# Altium schematic sheet powersupply1.SchDoc
size A; SheetNumber: 1; SheetTotal: 1; SPICEModelCacheSHAHFHRU: <root> / <DocumentId>SHAHFHRU</DocumentId> / </root>
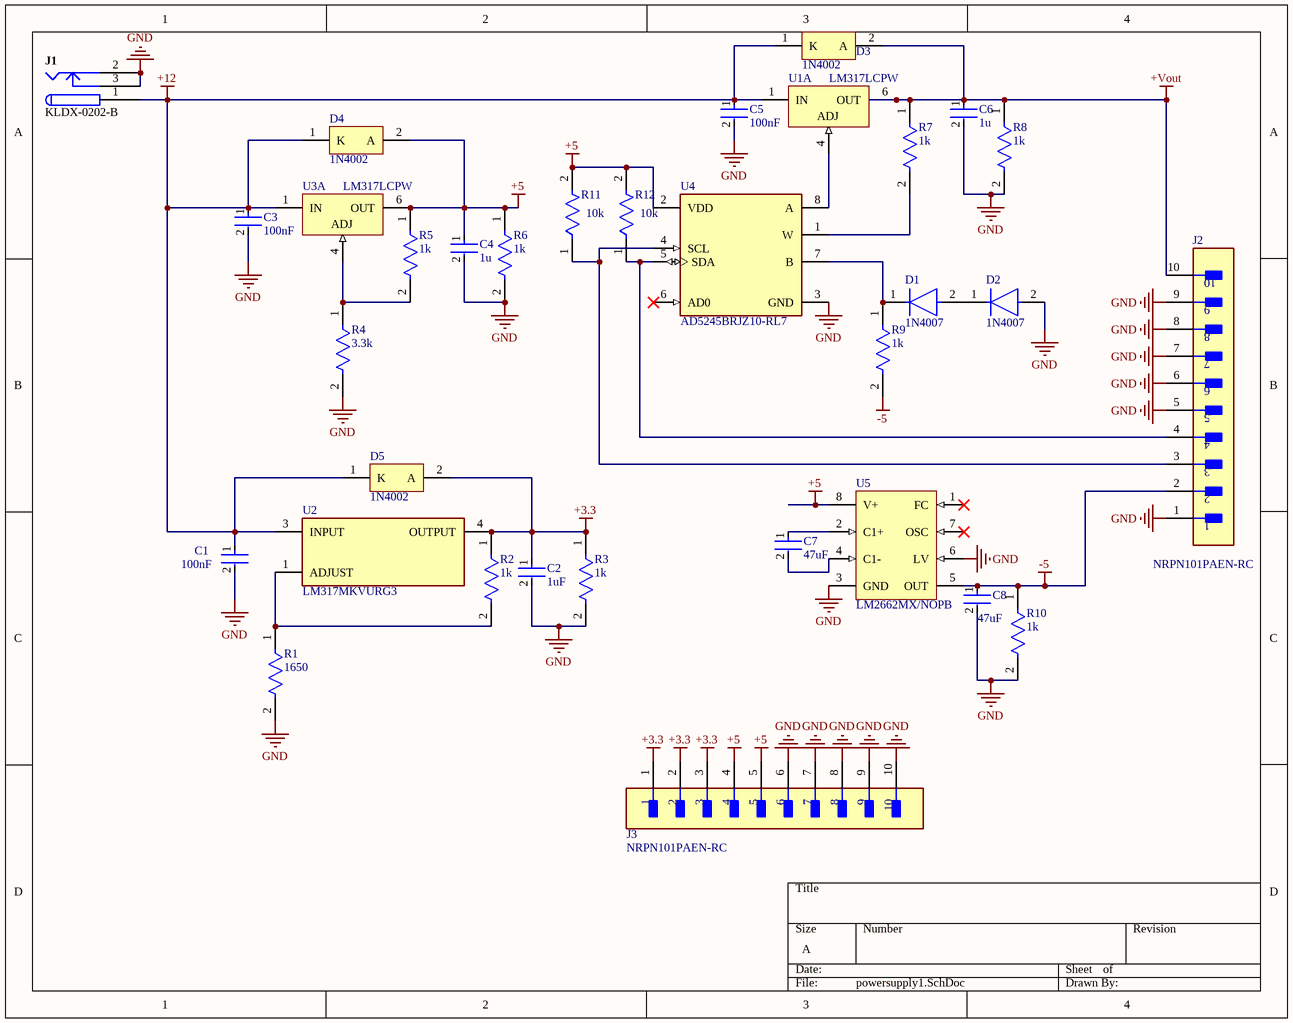
[diagram p0: powersupply1.SchDoc]

## Parts
C1  100nF  [FP-CC0805-0_85-MFG]
C2  1uF  [FP-CC0805-0_85-MFG]
C3  100nF  [FP-CC0805-0_85-MFG]
C4  1u  [FP-CC0805-0_85-MFG]
C5  100nF  [FP-CC0805-0_85-MFG]
C6  1u  [FP-CC0805-0_85-MFG]
C7  47uF  [FP-GRM21B-0_2-e0_2_0_7-IPC_A]
C8  47uF  [FP-GRM21B-0_2-e0_2_0_7-IPC_A]
D1  1N4007  [FP-1N4007-MFG]
D2  1N4007  [FP-1N4007-MFG]
D3  1N4002  [ONSC-AXIAL_LEAD-2-59-10_P]
D4  1N4002  [ONSC-AXIAL_LEAD-2-59-10_P]
D5  1N4002  [ONSC-AXIAL_LEAD-2-59-10_P]
J1  KLDX-0202-B  [KYCN-KLDX-0202-B_V]
J2  NRPN101PAEN-RC  [FP-NRPN101PAEN-RC-MFG]
J3  NRPN101PAEN-RC  [FP-NRPN101PAEN-RC-MFG]
R1  1650  [FP-RT0805-MFG]
R2  1k  [FP-RMCF0805-MFG]
R3  1k  [FP-RMCF0805-MFG]
R4  3.3k  [FP-CRGCQ0805-IPC_C]
R5  1k  [FP-RMCF0805-MFG]
R6  1k  [FP-RMCF0805-MFG]
R7  1k  [FP-RMCF0805-MFG]
R8  1k  [FP-RMCF0805-MFG]
R9  1k  [FP-RMCF0805-MFG]
R10  1k  [FP-RMCF0805-MFG]
R11  10k  [FP-RT0805-MFG]
R12  10k  [FP-RT0805-MFG]
U1  LM317LCPW  [PW0008A_L]  (part A of 2)
U2  LM317MKVURG3  [FP-KVU0003A-MFG]
U3  LM317LCPW  [PW0008A_L]  (part A of 2)
U4  AD5245BRJZ10-RL7  [FP-RJ-8-IPC_B]
U5  LM2662MX/NOPB  [D0008A_M]

## Nets
+3.3: C2.1 D5.2(A) J3.1 J3.2 J3.3 R2.1 R3.1 U2.4(OUTPUT)
+5: C4.1 D4.2(A) J3.4 J3.5 R5.1 R6.1 R11.2 R12.2 U3.6(OUT) U4.2(VDD) U5.8(V+)
+12: C1.1 C3.1 C5.1 D3.1(K) D4.1(K) D5.1(K) J1.1 U1.1(IN) U2.3(INPUT) U3.1(IN)
+Vout: C6.1 D3.2(A) J2.10 R7.1 R8.1 U1.6(OUT)
-5: C8.1 J2.2 R9.2 R10.1 U5.5(OUT)
GND: C1.2 C2.2 C3.2 C4.2 C5.2 C6.2 C8.2 D2.2(A) J1.2 J1.3 J2.1 J2.5 J2.6 J2.7 J2.8 J2.9 J3.6 J3.7 J3.8 J3.9 J3.10 R1.2 R3.2 R4.2 R6.2 R8.2 R10.2 U4.3(GND) U5.3(GND) U5.6(LV)
NetC7_1: C7.1 U5.2(C1+)
NetC7_2: C7.2 U5.4(C1-)
NetD1_1: D1.1(C) R9.1 U4.7(B)
NetD1_2: D1.2(A) D2.1(C)
NetJ2_3: J2.3 R11.1 U4.4(SCL)
NetJ2_4: J2.4 R12.1 U4.5(SDA)
NetR1_1: R1.1 R2.2 U2.1(ADJUST)
NetR4_1: R4.1 R5.2 U3.4(ADJ)
NetR7_2: R7.2 U4.1(W)
NetU1_4: U1.4(ADJ) U4.8(A)

Not connected (* = marked no-connect by the designer): U4 6(AD0)*; U5 1(FC)* 7(OSC)*

## Library data of the parts
C1 C3 C5 = CMP-03422-000691-1: CAP CER 0.1UF 25V X7R 0805; Manufacturer: Yageo; Manufacturer Part Number: CC0805MRX7R8BB104; Tolerance: 0.2; Material: Ceramic; Voltage Rating: 25 V; Ipc Land Pattern Name: CAPC200125X85; Automotive: No; Package: CC0805-0.85; Device Class L3: Ceramic Capacitors; Temperature Characteristic: X7R; Temperature Range High: +85°C; Temperature: -30°C to +85°C; Octopart: https://octopart.com/cc0805mrx7r8bb104-yageo-25629596; ComponentLink2URL: http://www.yageo.com/documents/recent/UPY-GPHC_Y5V_6.3V-to-50V_8.pdf; Height: 0.95mm; Capacitance: 100 nF; Mouser Description: Multilayer Ceramic Capacitors MLCC - SMD/SMT 100nF 25V X7R 20%; Device Class L1: Passive Components; Category: Cap; Device Class L2: Capacitors; RoHS: TRUE; Digikey Description: CAP CER 0.1UF 25V X7R 0805; Temperature Range Low: -30°C; Value: 100 nF; ComponentLink2Description: Datasheet; Footprint Url: http://www.yageo.com/exep/pages/download/literatures/UPY-C_GEN_24.pdf; Lead Free: Yes
C2 C4 C6 = CMP-03422-000816-1: CAP CER 1UF 6.3V X5R 0805; Manufacturer: Yageo; Manufacturer Part Number: CC0805KKX5R5BB105; Material: Ceramic; Tolerance: 0.1; Device Class L1: Passive Components; Temperature Characteristic: X5R; Voltage Rating: 6.3 V; Footprint Url: http://www.yageo.com/exep/pages/download/literatures/UPY-C_GEN_24.pdf; Value: 1 uF; Package: CC0805-0.85; Temperature Range High: +85°C; Height: 0.95mm; Temperature Range Low: -30°C; Lead Free: Yes; RoHS: TRUE; Octopart: https://octopart.com/cc0805kkx5r5bb105-yageo-71334571; Capacitance: 1 uF; Ipc Land Pattern Name: CAPC200125X85; Category: Cap; Digikey Description: CAP CER 1UF 6.3V X5R 0805; ComponentLink2URL: http://www.yageo.com/documents/recent/UPY-GPHC_Y5V_6.3V-to-50V_8.pdf; Automotive: No; Device Class L2: Capacitors; ComponentLink2Description: Datasheet; Device Class L3: Ceramic Capacitors; Temperature: -30°C to +85°C
C7 C8 = CMP-2000-06341-2: Chip Multilayer Ceramic Capacitors for General Purpose, 0805, 47uF, X5R, 15%, 20%, 10V; Dissipation Factor: 0.035%; Length: 2mm; Voltage Rating: 10V; Mount: Surface Mount; Width: 0.049inch; Voltage Rating (DC): 10V; Lead Free: Lead Free; REACH SVHC: No SVHC; Termination: SMD/SMT; Case/Package: 0805; Dielectric: X5R; Capacitance: 47uF; Packaging: Tape and Reel; Max Operating Temperature: 85°C; Tolerance: 20%; Thickness: 0.057inch; Dielectric Material: Ceramic; Min Operating Temperature: -55°C; Height: 1.25mm; Case Code (Imperial): 0805; Case Code (Metric): 2012; Depth: 1.25mm; Voltage: 10V
D1 D2 = CMP-123542-000001-1: Rectifier diode 1000 V 1 A DO-41, ,; Manufacturer: Diotec; Max Surge Forward Current: 27A; Forward Current: 1A; Max Junction Temp: +175°C; Reverse Voltage: 1000V; Value: 15pF; Peak Reverse Current: 5uA; Category: Diode; Temperature Range Low: -50°C; Automotive: No; Temperature: -50°C to +175°C; Lead Free: Yes; ComponentLink2Description: Datasheet; Max Repetitive Reverse Voltage: 1000V; ComponentLink2URL: https://datasheet.octopart.com/1N4007-Diotec-datasheet-62346875.pdf; Manufacturer Part Number: 1N4007; Device Class L3: Rectifier Diodes; Height: 2.8mm; Octopart: https://octopart.com/1n4007-diotec-4040411; Package: 1N4007; Temperature Range High: +175°C; Device Class L1: Discrete Semiconductors; Device Class L2: Diodes; RoHS: TRUE; Capacitance: 15pF; Ipc Land Pattern Name: DIOAD888W100L520D280
D3-D5 = CMP-0902-00207-1: Standard Recovery Rectifier, 2-Pin Axial_Lead, Pb-Free, Bulk Bag; Manufacturer: On Semiconductor; IO(rec) Max (A): 1; IFSM Max (A): 30; VRRM Max (V): 100; ComponentLink3Description: Package Specification; ComponentLink1Description: Manufacturer URL; Type: Standard Recovery; PackageVersion: Rev. U, 02/2005; Mounting Technology: Through Hole; ComponentLink1URL: http://www.onsemi.com/; ComponentLink3URL: http://www.onsemi.cn/pub_link/Collateral/59-10.PDF; ComponentLink2URL: http://www.onsemi.com/pub_link/Collateral/1N4001-D.PDF; Packing: Bulk Bag; PackageDescription: 2-Pin, Axial Lead, Diameter 2.35 mm; ComponentLink2Description: Datasheet; PartNumber: 1N4002; DatasheetVersion: Rev. 13; PackageReference: AXIAL_LEAD-2-59-10; RoHS: TRUE
J1 = CMP-0256-00001-1: 3 Conductor Power Jack, 2 break 2 aux contacts; ComponentLink2URL: http://anacapa.kycon.com/Catalog_PDF/KLDX_0202.pdf; PackageReference: KLDX-0202-B; Contact Finish: Brass; ComponentLink2Description: Datasheet; Mounting Technology: Through Hole; PackageDescription: Jack, 9 x 14.5 mm Body, 2.5 mm Center Pin Diameter; ComponentLink1Description: Manufacturer URL; PartNumber: KLDX-0202-B; ComponentLink1URL: http://kycon.com/
J2 J3 = CMP-25680-000006-1: CONN HEADER VERT 10POS 2MM; Manufacturer: Sullins; Current Rating: 2A; Conn Gender: Male; Voltage Rating: 150V; Conn Orientation: Straight; Number Of Contacts: 10; Temperature: -40°C to +105°C; Manufacturer Part Number: NRPN101PAEN-RC; Package: 0; Lead Free: Yes; Device Class L3: unset; Octopart: https://octopart.com/nrpn101paen-rc-sullins-18674398; Device Class L1: Connectors; Contact Material: Gold,Nickel; ComponentLink2URL: https://s3.amazonaws.com/catalogspreads-pdf/PAGE104-105%202mm%20MALE%20HDR%20ST%20RA%20SMT.pdf; Footprint Url: https://drawings-pdf.s3.amazonaws.com/10531.pdf; Height: 5.95mm; Digikey Description: CONN HEADER VERT 10POS 2MM; Category: Conn; Automotive: No; Number Of Rows: 1; Device Class L2: Headers and Wire Housings; Temperature Range High: +105°C; Temperature Range Low: -40°C; Pitch: 2mm; RoHS: TRUE; ComponentLink2Description: Datasheet
R1 = CMP-03412-005070-1: RES SMD 1.65K OHM 1% 1/8W 0805; Manufacturer: Yageo; Manufacturer Part Number: RT0805FRE071K65L; Power Rating: 0.125W; Tolerance: 0.0001; Resistance: 1.65KΩ; Temperature Coefficient: 50 ppm/°C; Voltage Rating: 150V; Value: 1.65KΩ; ComponentLink2URL: http://www.yageo.com/documents/recent/PYu-RT_1-to-0.01_RoHS_L_9.pdf; Height: 0.6mm; Temperature Range High: +155°C; Device Class L3: Chip SMD Resistors; Octopart: https://octopart.com/rt0805fre071k65l-yageo-1226722; ComponentLink2Description: Datasheet; Digikey Description: RES SMD 1.65K OHM 1% 1/8W 0805; Mouser Description: Thin Film Resistors - SMD 1/8W 1.65K ohm 1% 50ppm; Temperature: -55°C to +155°C; RoHS: TRUE; Temperature Range Low: -55°C; Composition: Thin Film; Footprint Url: http://www.yageo.com/exep/pages/download/literatures/PYu-R_Mount_10.pdf; Package: RT0805; Ipc Land Pattern Name: RESC200125X50; Series: RT; Category: Res; Lead Free: Yes; Device Class L2: Resistors; Device Class L1: Passive Components; Automotive: No
R2 R3 R5-R10 = CMP-26527-002945-1: 1kΩ ±1% 0.125W 0805 Thick Film Chip Resistor AEC-Q200 compliant; Resistance: 1kR; Max Power Dissipation: 125mW; Temperature Coefficient: 100ppm/°C; Series: RMCF; Packaging: Tape and Reel; Depth: 1.25mm; Tolerance: 1%; Contact Plating: Tin; Height: 0.026inch; Length: 2mm; Resistor Type: Thick Film; Lead Free: Lead Free; Width: 0.049inch; Military Standard: Not; RoHS Compliant: Yes; Case/Package: 0805; Min Operating Temperature: -55°C; Mount: Surface Mount; Max Operating Temperature: 155°C; Construction: Rectangular; Features: Automotive AEC-Q200; Number of Terminations: 2; Radiation Hardening: No
R4 = CMP-03211-009851-1: CRGCQ0805 3.3KΩ 0.125W ±100ppm/°C 5% 150V; Manufacturer: TE Connectivity; Manufacturer Part Number: CRGCQ0805J3K3; Automotive Grade: Grade 800; Tolerance: 0.05; RoHS: TRUE; Temperature Range Low: -55°C; Resistance: 3.3KΩ; Height: 0.65mm; Temperature: -55°C to +155°C; Device Class L2: Resistors; Composition: Thick Film; Lead Free: Yes; ComponentLink2Description: Datasheet; ComponentLink2URL: https://www.te.com/commerce/DocumentDelivery/DDEController?Action=showdoc&DocId=Data+Sheet%7F1773204-3%7F1%7Fpdf%7FEnglish%7FENG_DS_1773204-3_1.pdf%7F4-2176341-809; Package: CRGCQ0805; Series: CRGCQ; Device Class L1: Passive Components; Ambient Temperature Range High: +70°C; Power Rating: 0.125W; Ipc Land Pattern Name: RESC200125X55; Temperature Coefficient: ±100ppm/°C; Automotive: Yes; Device Class L3: Chip SMD Resistors; Octopart: https://octopart.com/crgcq0805j3k3-te+connectivity-91018225; Temperature Range High: +155°C; Category: Res; Value: 3.3KΩ; Voltage Rating: 150V
R11 R12 = CMP-03412-035478-1: RES SMD 10K OHM 1% 1/8W 0805; Manufacturer Part Number: RT0805FRD0710KL; Manufacturer: Yageo; Tolerance: 0.0001; Temperature Coefficient: 25 ppm/°C; Power Rating: 0.125W; Value: 10KΩ; Voltage Rating: 150V; RoHS: TRUE; Footprint Url: http://www.yageo.com/exep/pages/download/literatures/PYu-R_Mount_10.pdf; Series: RT; Octopart: https://octopart.com/rt0805frd0710kl-yageo-71399701; Digikey Description: RES SMD 10K OHM 1% 1/8W 0805; Composition: Thin Film; Device Class L1: Passive Components; Automotive: No; ComponentLink2Description: Datasheet; Ipc Land Pattern Name: RESC200125X50; Device Class L2: Resistors; Resistance: 10KΩ; Temperature Range Low: -55°C; Device Class L3: Chip SMD Resistors; ComponentLink2URL: http://www.yageo.com/documents/recent/PYu-RT_1-to-0.01_RoHS_L_9.pdf; Temperature: -55°C to +155°C; Category: Res; Temperature Range High: +155°C; Lead Free: Yes; Package: RT0805; Height: 0.6mm
U1 U3 = CMP-0324-00206-3: Adjustable Regulator with 3.7 to 38 V Input and 1.2 to 32 V Output, 0 to 125 degC, 8-Pin TSSOP (PW), Green (RoHS & no Sb/Br); Manufacturer: Texas Instruments; Iout(Max)(A): 0.1; Vout(Max)(V): 32; Vin(Max)(V): 38; Vout(Min)(V): 1.2; Vin(Min)(V): 3.7; ComponentLink3Description: URL Link1; Mounting Technology: Surface Mount; DatasheetVersion: SLCS144D; ComponentLink3URL: Samples URL:http://www.ti.com/product/lm317l#samples; ComponentLink2Description: Package Specification; Code_JEDEC: MO-153; PackageDescription: 8-Pin Plastic Thin Small Outline Package 3 x 4.4 mm Body ,0.65 mm Pitch; PartNumber: LM317LCPW; ComponentLink2URL: http://www.ti.com/litv/pdf/mtss001d; ComponentLink1Description: Datasheet; PackageReference: PW0008A; Eco-Plan: Green (RoHS & no Sb/Br); ComponentLink1URL: http://www.ti.com/general/docs/lit/getliterature.tsp?genericPartNumber=LM317L&fileType=pdf; PackageVersion: revG, Feb-2011
U2 = CMP-04917-000136-1: IC REG LIN POS ADJ 500MA TO252-3; Min Output Voltage: 1.25V; Dropout Voltage: 2V; Polarity: Positive; Reference Voltage: 1.3V; Max Input Voltage: 40V; Min Input Voltage: 4.2V; Power Supply Rejection Ratio (PSRR): 80dB; Number of Outputs: 1; Max Output Voltage: 37V; Output Type: Adjustable; Quiescent Current: 3.5mA; Radiation Hardening: No; Number of Pins: 3; Package Quantity: 2500; RoHS Compliant: Yes; Height: 2.39mm; Contact Plating: Tin; Min Operating Temperature: -40°C; Packaging: Tape and Reel; Case/Package: TO-252-3; Weight: 0.011598oz; Length: 6.7mm; Max Output Current: 500mA; Number of Regulators: 1; Max Operating Temperature: 125°C; Width: 6.22mm; REACH SVHC: No SVHC; Output Voltage: 37V; Lead Free: Lead Free; Output Current: 500mA; Min Current Limit: 500mA; Mount: Surface Mount
U4 = CMP-09083-000109-1: IC DGT POT 10KOHM 256TAP SOT23-8; Resistance: 10kR; Number of Positions: 256; Frequency: 400kHz; Quiescent Current: 3uA; Resistance Tolerance: 30%; Memory Type: Volatile; -3db Bandwidth: 1.2MHz; Operating Supply Voltage: 5.5V; Number of Circuits: 1; Interface: I2C; Temperature Coefficient: 45ppm/°C; Min Supply Voltage: 2.7V; Max Supply Current: 3uA; REACH SVHC: No SVHC; Lead Free: Contains Lead; Package Quantity: 3000; Number of Taps: 256; Case/Package: SOT-23; Operating Supply Current: 3uA; Mount: Surface Mount; RoHS Compliant: Yes; Supply Current: 3uA; Series: -; Number of Pins: 8; Min Operating Temperature: -40°C; Contact Plating: Gold; Max Operating Temperature: 125°C; Packaging: Tape and Reel; Max Supply Voltage: 5.5V; Nominal Supply Current: 3uA; Number of Elements: 1; Taper: Linear; Tolerance: 30%; Radiation Hardening: No
U5 = CMP-0065-00025-3: Switched Capacitor Voltage Converter, 8-pin Narrow SOIC, Pb-Free; Manufacturer: Texas Instruments; PowerWise: N; CompType: Switch Caps; PackageTopMarking: NSZXTT*LM26*62M; PackageReference: D0008A; PinCount: 8; RoHS: Y; ComponentLink1URL: http://www.ti.com/general/docs/lit/getliterature.tsp?genericPartNumber=LM2662&fileType=pdf; Code_IPC: SOIC127P600-8; ComponentLink1Description: Datasheet URL; PackageDescription: SOIC Narrow, 4.9 x 3.9 x 1.45mm, 8 Lead, 1.27mm Pitch; Code_JEDEC: MS-012-AA